# EAGLE design 3DPOV (EAGLE 6.6.0)
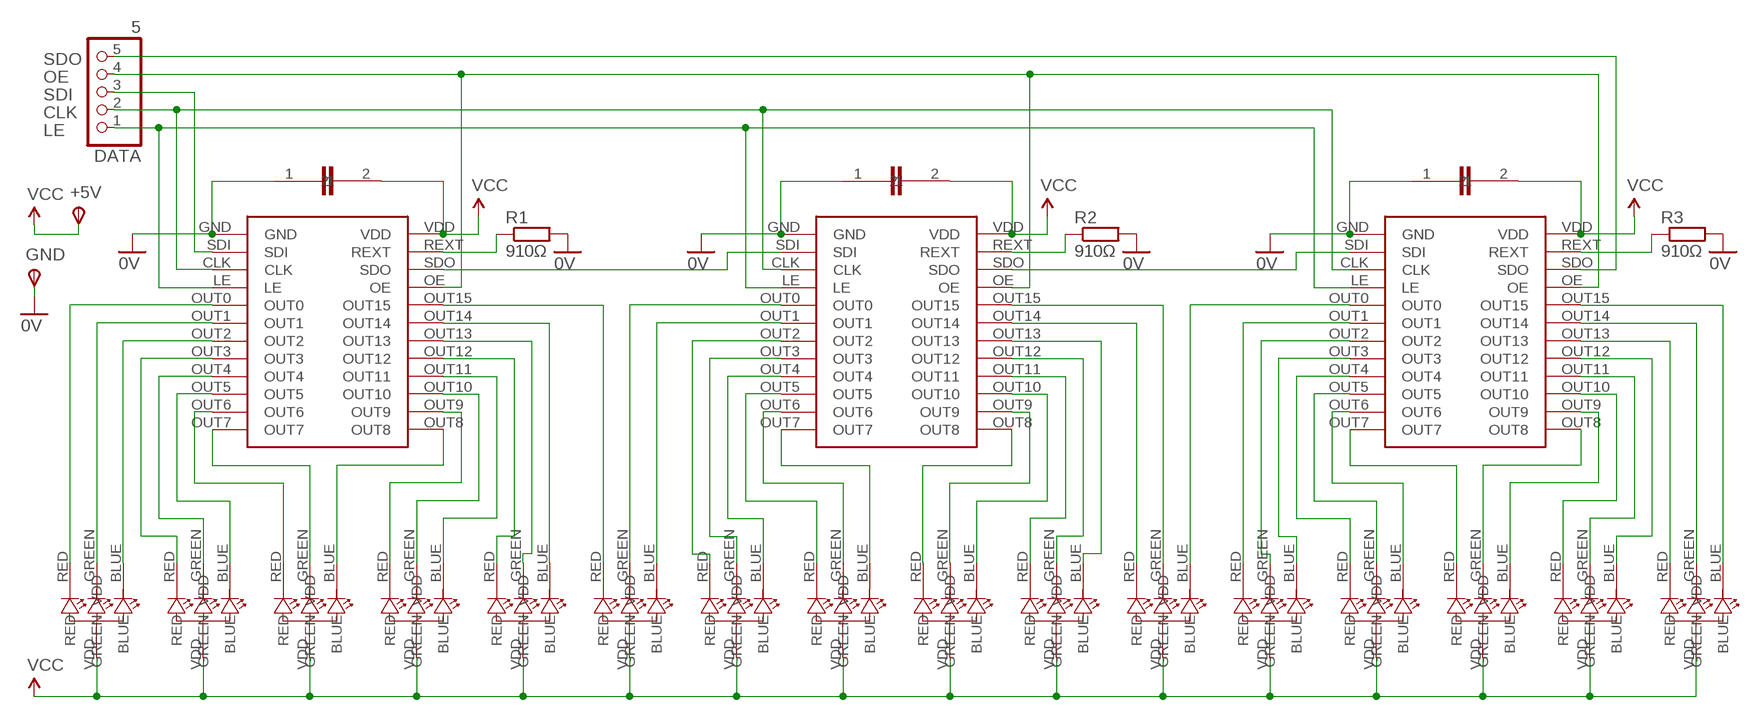
[diagram p0: schematic, sheet 1]

## Parts
+5V  TPSPAD1-20  [P1-20]
CAP1  1µF  CAP  [CAP]
CAP2  1µF  CAP  [CAP]
CAP3  1µF  CAP  [CAP]
DATA  5  PINHD-1X5  [1X05]
GND  TPSPAD1-20  [P1-20]
IC1  TLC5927  [DBQ]
IC2  TLC5927  [DBQ]
IC3  TLC5927  [DBQ]
R1  910Ω  R-EU_0207/7  [0207/7]
R2  910Ω  R-EU_0207/7  [0207/7]
R3  910Ω  R-EU_0207/7  [0207/7]
U$1  SMDLED  [SMDLED]
U$2  SMDLED  [SMDLED]
U$4  SMDLED  [SMDLED]
U$5  SMDLED  [SMDLED]
U$6  SMDLED  [SMDLED]
U$7  SMDLED  [SMDLED]
U$10  SMDLED  [SMDLED]
U$11  SMDLED  [SMDLED]
U$12  SMDLED  [SMDLED]
U$13  SMDLED  [SMDLED]
U$14  SMDLED  [SMDLED]
U$15  SMDLED  [SMDLED]
U$16  SMDLED  [SMDLED]
U$17  SMDLED  [SMDLED]
U$18  SMDLED  [SMDLED]
U$19  SMDLED  [SMDLED]

## Nets
0V: CAP1.1 CAP2.1 CAP3.1 GND.TP(PP) IC1.GND IC2.GND IC3.GND R1.2 R2.2 R3.2
CLK: DATA.2 IC1.CLK IC2.CLK IC3.CLK
LE: DATA.1 IC1.LE IC2.LE IC3.LE
N$1: IC1.OUT0 U$4.RED
N$2: IC1.OUT1 U$4.GREEN
N$3: IC1.OUT2 U$4.BLUE
N$4: IC1.OUT3 U$5.RED
N$5: IC1.OUT4 U$5.GREEN
N$6: IC1.OUT5 U$5.BLUE
N$7: IC1.OUT7 U$6.GREEN
N$8: IC1.OUT6 U$6.RED
N$9: IC1.OUT8 U$6.BLUE
N$10: IC1.OUT9 U$7.RED
N$11: IC1.OUT10 U$7.GREEN
N$12: IC1.OUT11 U$7.BLUE
N$13: IC1.OUT12 U$2.RED
N$14: IC1.OUT13 U$2.GREEN
N$15: IC1.OUT14 U$2.BLUE
N$16: IC1.OUT15 U$1.RED
N$17: IC2.OUT0 U$1.GREEN
N$18: IC2.OUT1 U$1.BLUE
N$19: IC2.OUT2 U$10.RED
N$20: IC2.OUT3 U$10.GREEN
N$21: IC2.OUT4 U$10.BLUE
N$22: IC2.OUT7 U$11.BLUE
N$23: IC2.OUT6 U$11.GREEN
N$24: IC2.OUT5 U$11.RED
N$28: IC2.OUT11 U$13.RED
N$29: IC2.OUT12 U$13.GREEN
N$30: IC2.OUT13 U$13.BLUE
N$31: IC2.OUT14 U$14.RED
N$32: IC2.OUT15 U$14.GREEN
N$33: IC3.OUT0 U$14.BLUE
N$34: IC3.OUT1 U$15.RED
N$35: IC3.OUT2 U$15.GREEN
N$36: IC3.OUT3 U$15.BLUE
N$37: IC3.OUT4 U$16.RED
N$38: IC3.OUT5 U$16.GREEN
N$39: IC3.OUT7 U$17.RED
N$40: IC3.OUT6 U$16.BLUE
N$41: IC3.OUT8 U$17.GREEN
N$42: IC3.OUT9 U$17.BLUE
N$43: IC3.OUT10 U$18.RED
N$44: IC3.OUT11 U$18.GREEN
N$45: IC3.OUT12 U$18.BLUE
N$46: IC3.OUT13 U$19.RED
N$47: IC3.OUT14 U$19.GREEN
N$48: IC3.OUT15 U$19.BLUE
N$49: IC3.REXT R3.1
N$50: IC1.SDO IC2.SDI
N$51: IC2.SDO IC3.SDI
N$52: IC2.REXT R2.1
N$53: IC1.REXT R1.1
N$54: IC2.OUT8 U$12.RED
N$55: IC2.OUT9 U$12.GREEN
N$57: IC2.OUT10 U$12.BLUE
OE: DATA.4 IC1.OE IC2.OE IC3.OE
SDI: DATA.3 IC1.SDI
SDO: DATA.5 IC3.SDO
VCC: +5V.TP(PP) CAP1.2 CAP2.2 CAP3.2 IC1.VDD IC2.VDD IC3.VDD U$1.VDD U$2.VDD U$4.VDD U$5.VDD U$6.VDD U$7.VDD U$10.VDD U$11.VDD U$12.VDD U$13.VDD U$14.VDD U$15.VDD U$16.VDD U$17.VDD U$18.VDD U$19.VDD

## Library data of the parts
+5V GND = testpad:TPS: TEST PIN
CAP1-CAP3 = MYLIBRARY:CAP
DATA = pinhead:PINHD-1X5: PIN HEADER
IC1-IC3 = MYLIBRARY:TLC5927: 16-channel constant-current LED sink driver
R1-R3 = resistor:R-EU_: RESISTOR, European symbol
U$1 U$2 U$4-U$7 U$10-U$19 = MYLIBRARY:SMDLED

## Board
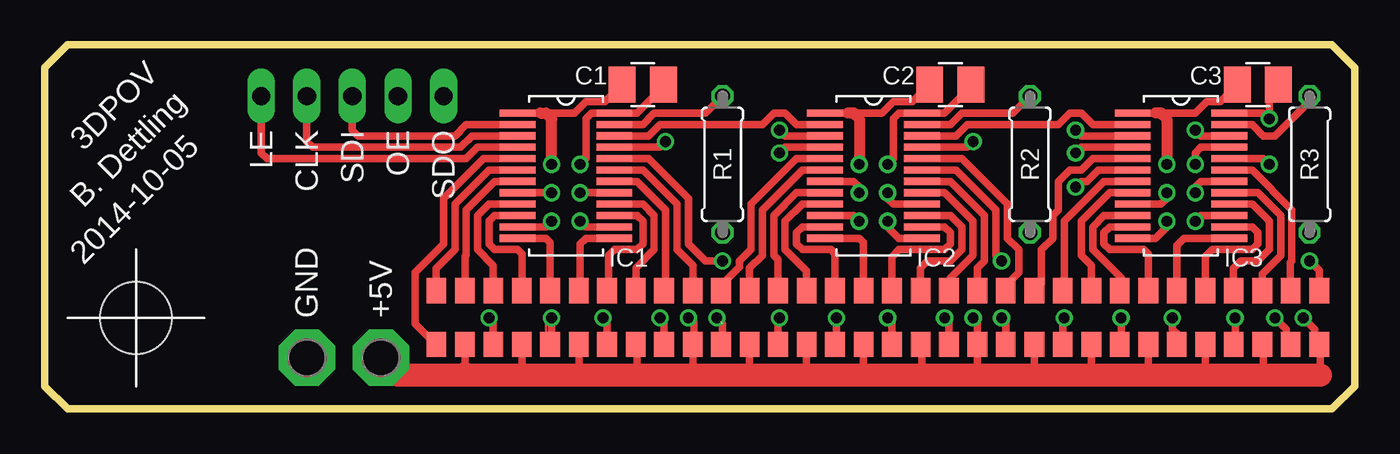
[diagram p1: board, top side]
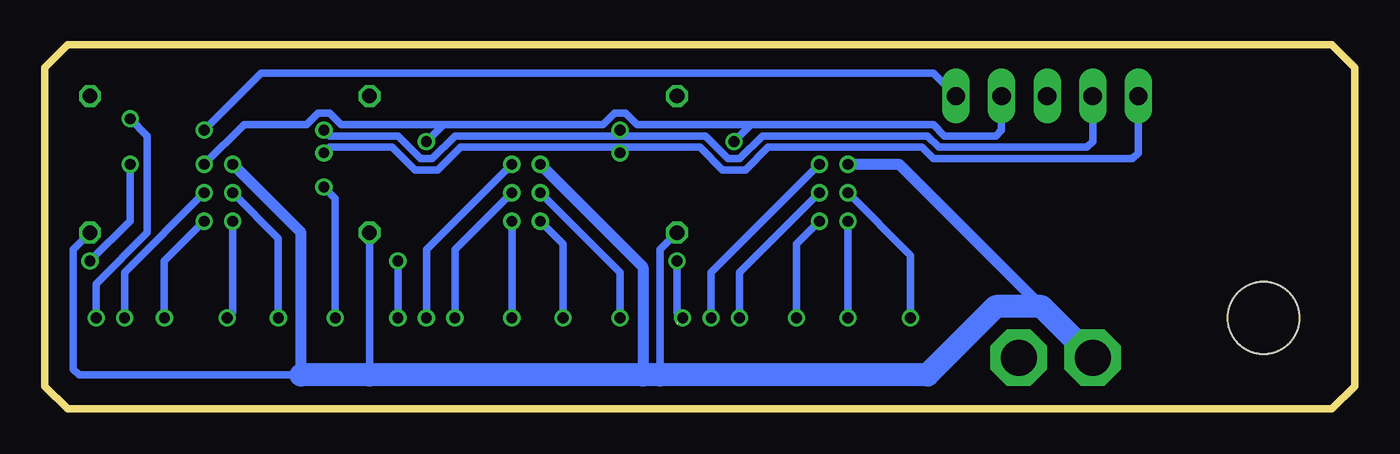
[diagram p2: board, bottom side, seen from below]

Size 73.03 x 20.32 mm. Coordinates in mm from the lower left corner, seen from the top.
Outline: 73.03,1.27 73.03,19.05 71.75,20.32 1.27,20.32 0,19.05 0,1.27 1.27,0 71.75,0 73.03,1.27
Copper layers (1*16): Top 0.0356mm / dielectric 1.5011mm / Bottom 0.0356mm
Design rules "LaenPCBOrder": minimum track width 6mil, minimum drill 13mil, track to track 6mil, track to pad 6mil, pad to pad 6mil, via to via 6mil, smd to smd 6mil, copper to edge 15mil, drill to drill 6mil, minimum pad ring 7mil, minimum via ring 7mil, stop-mask expansion 3mil, vias tented up to drill 0mil, thermal gap 10mil
Holes 4.01 mm at 5.08,5.08

### Footprints (pad centres in the part's own frame; a part is rotated, then mirrored left to right if it is on the bottom)
P1-20 = drill 2.007 pad 3.15 octagon: TP 0,0
CAP = smd 1.5 x 2: 1 -1.15,0; 2 1.15,0
1X05 = drill 1.016 long: 1 -5.08,0; 2 -2.54,0; 3 0,0; 4 2.54,0; 5 5.08,0
DBQ = smd 2 x 0.4: CLK 0,-1.27; GND 0,0; LE 0,-1.905; OE 5.397,-1.905; OUT0 0,-2.54; OUT1 0,-3.175; OUT2 0,-3.81; OUT3 0,-4.445; OUT4 0,-5.08; OUT5 0,-5.715; OUT6 0,-6.35; OUT7 0,-6.985; OUT8 5.397,-6.985; OUT9 5.397,-6.35; OUT10 5.397,-5.715; OUT11 5.397,-5.08; OUT12 5.397,-4.445; OUT13 5.397,-3.81; OUT14 5.397,-3.175; OUT15 5.397,-2.54; REXT 5.397,-0.635; SDI 0,-0.635; SDO 5.397,-1.27; VDD 5.397,0
0207/7 = drill 0.813 octagon: 1 -3.81,0; 2 3.81,0
SMDLED = smd 1.1 x 1.4: BLUE 2.15,-0.7; GREEN 0.55,-0.7; RED 0.55,-3.7; VDD 2.15,-3.7

### Placement (x,y rotation side)
+5V  18.73,2.86 0 top
CAP1  33.34,18.1 0 top
CAP2  50.48,18.1 0 top
CAP3  67.63,18.1 0 top
DATA  17.14,17.46 0 top
GND  14.61,2.86 0 top
IC1  26.35,16.51 0 top
IC2  43.5,16.51 0 top
IC3  60.64,16.51 0 top
R1  37.78,13.65 270 top
R2  54.93,13.65 270 top
R3  70.51,13.65 270 top
U$1  37.15,7.3 0 top
U$2  33.97,7.3 0 top
U$4  21.27,7.3 0 top
U$5  24.45,7.3 0 top
U$6  27.62,7.3 0 top
U$7  30.8,7.3 0 top
U$10  40.32,7.3 0 top
U$11  43.5,7.3 0 top
U$12  46.67,7.3 0 top
U$13  49.85,7.3 0 top
U$14  53.02,7.3 0 top
U$15  56.2,7.3 0 top
U$16  59.37,7.3 0 top
U$17  62.55,7.3 0 top
U$18  65.72,7.3 0 top
U$19  68.9,7.3 0 top

### Tracks (layer width: path | path; a pad name or v marks a point on that pad's centre or on a via)
0V  (via drill 0.6)
  Top 0.406: IC2.GND 44.77,16.51 46.67,16.51 47.31,17.14 48.38,17.14 CAP2.1 | CAP3.1 65.53,17.14 64.77,17.14 64.14,16.51 61.91,16.51 IC3.GND | IC1.GND 27.62,16.51 29.53,16.51 30.16,17.14 31.23,17.14 CAP1.1
  Top 0.61: v62.55,13.65 62.55,16.19 62.23,16.51 61.91,16.51 | v45.4,13.65 45.4,16.19 45.09,16.51 44.77,16.51 | v28.26,13.65 28.26,16.19 27.94,16.51 27.62,16.51
  Bottom 0.406: 58.74,1.91 71.12,1.91 71.44,2.22 71.44,8.89 70.51,9.82 R3.2 | R2.2 54.93,1.91 | 38.73,1.91 38.73,8.89 R1.2
  Bottom 0.61: v62.55,13.65 58.74,9.84 58.74,1.91 | v45.4,13.65 39.69,7.94 39.69,1.91 | v28.26,13.65 25.4,13.65 17.14,5.4
  Bottom 1.27: 58.74,1.91 54.93,1.91 39.69,1.91 38.73,1.91 23.81,1.91 20,5.71 17.46,5.71 17.14,5.4 GND.TP
CLK  (via drill 0.6)
  Top 0.406: IC2.CLK 41.27,15.24 v40.96,15.56 | IC3.CLK 57.78,15.24 v57.47,15.56 | DATA.2 14.61,14.92 14.92,14.61 23.18,14.61 23.81,15.24 IC1.CLK
  Bottom 0.406: 40.64,15.24 36.2,15.24 34.92,13.97 34.29,13.97 33.02,15.24 23.81,15.24 23.18,14.61 14.92,14.61 14.61,14.92 DATA.2 | 40.64,15.24 v40.96,15.56 41.27,15.24 | 41.27,15.24 50.16,15.24 51.44,13.97 52.07,13.97 53.34,15.24 57.15,15.24 v57.47,15.56 | 40.64,15.24 41.27,15.24
LE  (via drill 0.6)
  Top 0.406: IC1.LE 24.13,14.61 23.5,13.97 12.38,13.97 12.06,14.29 DATA.1 | v57.47,14.29 57.78,14.61 IC3.LE | v40.96,14.29 41.27,14.61 IC2.LE
  Bottom 0.406: DATA.1 12.06,14.29 12.38,13.97 23.5,13.97 24.13,14.61 32.7,14.61 33.97,13.34 35.24,13.34 36.51,14.61 40.64,14.61 | v57.47,14.29 57.15,14.61 53.66,14.61 52.39,13.34 51.12,13.34 49.85,14.61 41.27,14.61 | 40.64,14.61 v40.96,14.29 41.27,14.61 | 40.64,14.61 41.27,14.61
N$1
  Top 0.406: IC1.OUT0 24.45,13.97 22.23,11.75 22.23,9.21 20.64,7.62 20.64,4.76 21.8,3.6 U$4.RED
N$2
  Top 0.406: 21.91,6.67 U$4.GREEN 21.82,7.85 22.86,8.89 22.86,11.43 24.77,13.34 IC1.OUT1
N$3
  Top 0.406: IC1.OUT2 25.08,12.7 23.5,11.11 23.5,8.57 23.42,8.5 U$4.BLUE
N$4  (via drill 0.6)
  Top 0.406: IC1.OUT3 v28.26,12.06 | v24.77,5.08 25,4.85 U$5.RED
  Bottom 0.406: v28.26,12.06 24.77,8.57 v24.77,5.08
N$5
  Top 0.406: U$5.GREEN 25,8.02 24.13,8.89 24.13,10.79 24.77,11.43 IC1.OUT4
N$6
  Top 0.406: IC1.OUT5 25.08,10.79 24.77,10.48 24.77,9.21 25.08,8.89 26.35,8.89 26.6,8.64 U$5.BLUE 26.35,6.85
N$7
  Top 0.406: IC1.OUT7 27.94,9.53 28.17,9.29 U$6.GREEN 27.94,6.83
N$8  (via drill 0.6)
  Top 0.152: U$6.RED 27.94,3.81 27.94,5.08 v28.26,5.08
  Top 0.406: IC1.OUT6 27.94,10.16 v28.26,10.48 | v28.26,5.08 28.26,3.69
  Bottom 0.406: v28.26,10.48 v28.26,5.08
N$9
  Top 0.406: IC1.OUT8 30.16,9.53 29.84,9.21 29.84,6.67 U$6.BLUE
N$10  (via drill 0.6)
  Top 0.406: v29.84,10.48 30.16,10.16 IC1.OUT9 | 31.43,3.81 U$7.RED 31.35,4.85 v31.11,5.08
  Bottom 0.406: v29.84,10.48 31.11,9.21 v31.11,5.08
N$11
  Top 0.406: 31.43,6.67 U$7.GREEN 31.43,6.69 31.43,8.57 31.75,8.89 33.02,8.89 33.34,9.21 33.34,10.48 33.02,10.79 IC1.OUT10
N$12
  Top 0.406: IC1.OUT11 33.34,11.43 33.97,10.79 33.97,8.89 32.95,7.87 U$7.BLUE
N$13  (via drill 0.6)
  Top 0.406: IC1.OUT12 v29.84,12.06 | v34.29,5.08 34.52,4.85 U$2.RED
  Bottom 0.406: v29.84,12.06 34.29,7.62 v34.29,5.08
N$14
  Top 0.406: IC1.OUT13 33.02,12.7 34.61,11.11 34.61,6.67 34.52,6.67 U$2.GREEN
N$15
  Top 0.406: IC1.OUT14 33.34,13.34 35.24,11.43 35.24,8.89 36.12,8.01 U$2.BLUE
N$16  (via drill 0.6)  (1 unrouted)
  Top 0.406: IC1.OUT15 33.66,13.97 35.88,11.75 35.88,9.21 36.83,8.26 v37.78,8.26 | 37.7,4.85 v37.47,5.08 | U$1.RED 37.78,3.6 37.78,4.76
  Bottom 0.406: v37.78,8.26 37.78,5.4 v37.47,5.08
N$17
  Top 0.406: IC2.OUT0 41.91,13.97 39.37,11.43 39.37,8.89 38.73,8.26 38.73,7.94 37.7,6.9 U$1.GREEN
N$18
  Top 0.406: IC2.OUT1 42.23,13.34 40.01,11.11 40.01,8.57 39.3,7.87 U$1.BLUE
N$19  (via drill 0.6)
  Top 0.406: IC2.OUT2 45.09,12.7 45.4,12.38 v45.4,12.06 | v40.96,5.08 40.87,5 U$10.RED
  Bottom 0.406: v45.4,12.06 40.96,7.62 v40.96,5.08
N$20
  Top 0.406: IC2.OUT3 41.91,12.06 40.64,10.79 40.64,8.57 40.87,8.34 U$10.GREEN 40.96,6.69
N$21
  Top 0.406: IC2.OUT4 42.23,11.43 41.27,10.48 41.27,8.89 42.47,7.69 U$10.BLUE 42.55,6.67
N$22
  Top 0.406: IC2.OUT7 45.4,9.53 45.65,9.28 U$11.BLUE
N$23
  Top 0.406: IC2.OUT6 42.23,10.16 41.91,9.84 41.91,9.21 42.23,8.89 43.81,8.89 44.05,8.66 U$11.GREEN 43.81,6.83
N$24  (via drill 0.6)
  Top 0.406: v44.13,5.08 44.13,3.81 U$11.RED | IC2.OUT5 45.09,10.79 v45.4,10.48
  Bottom 0.406: v45.4,10.48 44.13,9.21 v44.13,5.08
N$28  (via drill 0.6)
  Top 0.406: 48.58,11.43 IC2.OUT11 47.62,11.43 47.31,11.43 46.99,11.75 v46.99,12.06 | v50.16,5.08 50.4,4.85 U$13.RED
  Bottom 0.406: v46.99,12.06 50.16,8.89 v50.16,5.08
N$29
  Top 0.406: IC2.OUT12 50.16,12.06 51.75,10.48 51.75,8.57 50.48,7.3 50.48,6.69 U$13.GREEN
N$30
  Top 0.406: IC2.OUT13 50.48,12.7 52.39,10.79 52.39,8.26 52,7.87 U$13.BLUE
N$31  (via drill 0.6)
  Top 0.406: IC2.OUT14 50.8,13.34 53.02,11.11 53.02,8.57 v53.34,8.26 | v53.34,5.08 53.57,4.85 U$14.RED
  Bottom 0.406: v53.34,8.26 v53.34,5.08
N$32
  Top 0.406: IC2.OUT15 51.12,13.97 53.66,11.43 53.66,9.53 54.29,8.89 54.29,7.62 53.57,6.9 U$14.GREEN
N$33
  Top 0.406: 54.93,6.85 U$14.BLUE 55.56,6.99 55.56,8.89 56.2,9.53 56.2,10.79 56.52,11.11 56.52,12.7 57.15,13.34 57.78,13.34 58.42,13.97 IC3.OUT0
N$34  (via drill 0.6)
  Top 0.406: IC3.OUT1 58.74,13.34 58.1,12.7 57.78,12.7 v57.47,12.38 | v56.83,5.08 56.75,5 U$15.RED
  Bottom 0.406: v56.83,5.08 56.83,11.75 v57.47,12.38
N$35
  Top 0.406: IC3.OUT2 59.05,12.7 56.83,10.48 56.83,7.3 56.75,7.22 U$15.GREEN 56.83,6.69
N$36
  Top 0.406: U$15.BLUE 58.35,8.01 57.78,8.57 57.78,10.48 59.37,12.06 IC3.OUT3
N$37  (via drill 0.6)
  Top 0.406: v60.01,5.08 60.01,3.81 U$16.RED | IC3.OUT4 61.91,11.43 62.23,11.43 62.55,11.75 v62.55,12.06
  Bottom 0.406: v60.01,5.08 60.01,9.53 v62.55,12.06
N$38
  Top 0.406: IC3.OUT5 59.05,10.79 58.42,10.16 58.42,8.89 60.01,7.3 60.01,6.69 U$16.GREEN
N$39  (via drill 0.6)
  Top 0.406: v62.87,5.08 62.87,4.45 63.18,4.13 63.18,3.81 U$17.RED | IC3.OUT7 61.91,9.53 62.55,10.16 v62.55,10.48
  Bottom 0.406: v62.87,5.08 62.55,5.4 v62.55,10.48
N$40
  Top 0.406: IC3.OUT6 59.37,10.16 59.05,9.84 59.05,9.21 59.37,8.89 61.28,8.89 61.52,8.64 U$16.BLUE 61.28,6.85
N$41
  Top 0.406: IC3.OUT8 63.5,9.53 63.1,9.12 U$17.GREEN
N$42
  Top 0.406: IC3.OUT9 67.31,10.16 67.63,9.84 67.63,9.21 67.31,8.89 65.09,8.89 64.7,8.5 U$17.BLUE 64.77,6.67
N$43  (via drill 0.6)
  Top 0.406: v66.36,5.08 66.36,3.81 U$18.RED | IC3.OUT10 64.45,10.79 v64.14,10.48
  Bottom 0.406: v64.14,10.48 66.36,8.26 v66.36,5.08
N$44
  Top 0.406: IC3.OUT11 67.31,11.43 68.26,10.48 68.26,8.89 67.63,8.26 66.67,8.26 66.27,7.85 U$18.GREEN 66.36,6.69
N$45
  Top 0.406: U$18.BLUE 67.87,7.55 68.9,8.57 68.9,10.79 67.63,12.06 IC3.OUT12
N$46  (via drill 0.6)
  Top 0.406: IC3.OUT13 64.45,12.7 64.14,12.38 v64.14,12.06 | U$19.RED 69.22,3.83 69.22,4.45 v68.58,5.08
  Bottom 0.406: v64.14,12.06 68.58,7.62 v68.58,5.08
N$47
  Top 0.406: IC3.OUT14 67.31,13.34 69.53,11.11 69.53,8.26 69.45,8.17 U$19.GREEN 69.22,6.83
N$48  (via drill 0.6)
  Top 0.406: 71.12,6.67 U$19.BLUE | 71.12,6.67 U$19.BLUE | IC3.OUT15 67.94,13.97 v68.26,13.65 | U$19.BLUE 71.05,7.72 v70.51,8.26
  Bottom 0.406: v68.26,13.65 68.26,10.5 v70.51,8.26
N$49
  Top 0.406: IC3.REXT 67.31,15.88 67.94,15.24 68.58,15.24 70.51,17.17 R3.1
N$50
  Top 0.406: IC1.SDO 33.66,15.24 34.29,15.88 40.01,15.88 40.64,16.51 41.27,16.51 41.91,15.88 IC2.SDI
N$51
  Top 0.406: IC2.SDO 50.8,15.24 51.44,15.88 56.52,15.88 57.15,16.51 57.78,16.51 58.42,15.88 IC3.SDI
N$52
  Top 0.406: IC2.REXT 50.48,15.88 51.12,16.51 53.98,16.51 R2.1
N$53
  Top 0.406: IC1.REXT 33.34,15.88 33.97,16.51 36.83,16.51 R1.1
N$54  (via drill 0.6)
  Top 0.406: IC2.OUT8 47.62,9.53 46.99,10.16 v46.99,10.48 | v46.99,5.08 47.22,4.85 U$12.RED
  Bottom 0.406: v46.99,10.48 v46.99,5.08
N$55
  Top 0.406: IC2.OUT9 50.16,10.16 50.48,9.84 50.48,9.21 50.16,8.89 47.62,8.89 47.22,8.49 U$12.GREEN
N$57
  Top 0.406: IC2.OUT10 50.48,10.79 51.12,10.16 51.12,8.89 50.48,8.26 49.21,8.26 48.82,7.87 U$12.BLUE
OE  (via drill 0.6)
  Top 0.406: IC3.OE 64.45,14.61 64.14,14.29 v64.14,13.65 | IC2.OE 51.44,14.61 v51.75,14.92 | IC1.OE 34.29,14.61 v34.61,14.92
  Bottom 0.406: v64.14,13.65 61.91,15.88 58.42,15.88 57.78,16.51 57.15,16.51 56.52,15.88 50.8,15.88 | v34.61,14.92 33.66,15.88 | 50.8,15.88 41.91,15.88 41.27,16.51 40.64,16.51 40.01,15.88 33.66,15.88 | 33.66,15.88 23.5,15.88 22.86,15.24 20,15.24 19.68,15.56 DATA.4 | v51.75,14.92 50.8,15.88
SDI
  Top 0.406: DATA.3 17.14,15.56 17.46,15.24 22.86,15.24 23.5,15.88 IC1.SDI
SDO  (via drill 0.6)
  Top 0.406: IC3.SDO 64.45,15.24 v64.14,15.56
  Bottom 0.406: v64.14,15.56 60.96,18.73 23.5,18.73 DATA.5
VCC  (via drill 0.6)
  Top 0.406: U$7.VDD 33.02,3.81 33.02,1.91 | U$12.VDD 48.9,3.81 48.9,1.91 | 71.12,1.91 71.12,3.53 U$19.VDD 70.8,3.85 70.8,4.45 v70.17,5.08 | 67.94,3.49 67.87,3.56 U$18.VDD 67.94,3.53 67.94,1.91 | U$17.VDD 64.7,1.98 64.77,1.91 | U$16.VDD 61.52,2.15 61.28,1.91 | U$15.VDD 58.35,1.98 58.42,1.91 | U$14.VDD 55.17,1.98 55.24,1.91 | 52.07,1.91 52,1.98 U$13.VDD 52,4.83 v51.75,5.08 | U$11.VDD 45.65,1.98 45.72,1.91 | U$10.VDD 42.47,2.15 42.23,1.91 | 39.37,1.91 39.3,1.98 U$1.VDD | 36.2,1.91 36.12,1.98 U$2.VDD 36.2,3.6 36.2,4.83 36.12,4.83 v35.88,5.08 | U$6.VDD 29.77,1.98 29.84,1.91 | U$5.VDD 26.6,1.98 26.67,1.91 | U$4.VDD 23.42,1.98 23.5,1.91 | v29.84,13.65 30.16,13.97 30.16,16.19 30.48,16.51 IC1.VDD 33.02,16.51 34.49,17.98 CAP1.2 | v46.99,13.65 47.31,13.97 47.31,16.19 47.62,16.51 IC2.VDD 50.16,16.51 51.63,17.98 CAP2.2 | IC3.VDD 67.94,16.51 v68.26,16.19 68.26,17.58 CAP3.2
  Top 1.27: 23.5,1.91 26.67,1.91 29.84,1.91 33.02,1.91 36.2,1.91 39.37,1.91 42.23,1.91 45.72,1.91 48.9,1.91 52.07,1.91 55.24,1.91 58.42,1.91 61.28,1.91 64.77,1.91 67.94,1.91 71.12,1.91 | +5V.TP 19.68,1.91 23.35,1.91 23.42,1.98
  Bottom 0.406: v35.88,5.08 35.88,7.62 v29.84,13.65 | v46.99,13.65 51.75,8.89 v51.75,5.08 | v68.26,16.19 67.31,15.24 67.31,9.84 70.17,6.99 v70.17,5.08

### Text on the board
tNames: C1 | C2 | C3 | LE | CLK | SDI | OE | SDO | 3DPOV | R1 | R2 | R3 | B. Dettling | 2014-10-05 | IC1 | IC2 | IC3